# EAGLE design ConsoleSchematicFirst (EAGLE 7.1.0)
Schematic for ATTiny85 Console
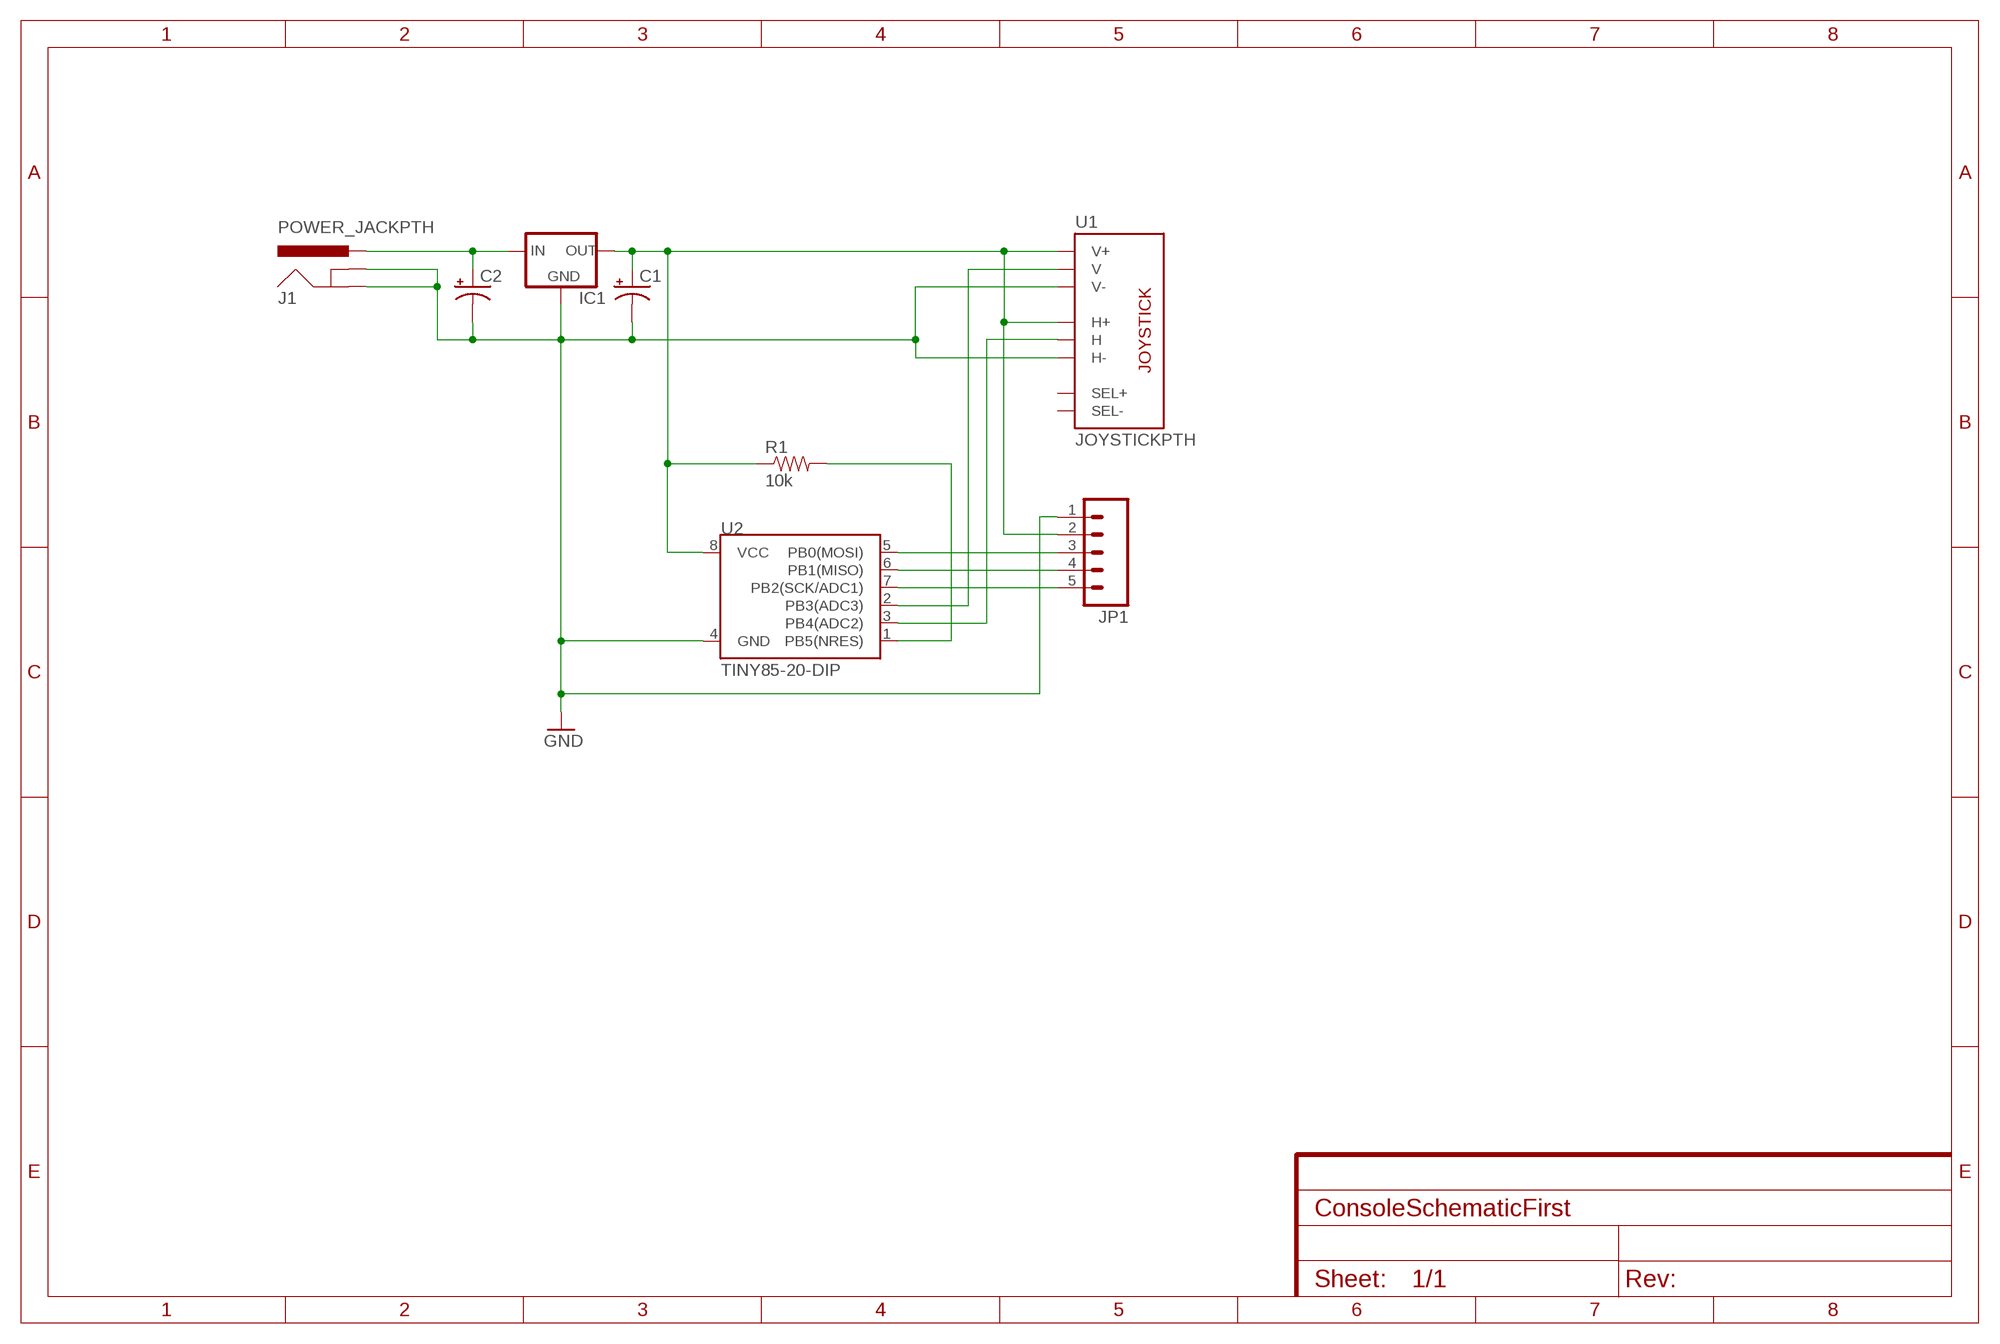
[diagram p0: schematic, sheet 1]

## Parts
C1  10UF-25V-20%(PTH)KIT  [CPOL-RADIAL-10UF-25V-KIT]
C2  10UF-25V-20%(PTH)KIT  [CPOL-RADIAL-10UF-25V-KIT]
IC1  V_REG_78XXSIDE  [78XXL]
J1  POWER_JACKPTH  [POWER_JACK_PTH]
JP1  M05LOCK  [1X05_LOCK]
R1  10k  10KOHM-1/4W-1%(PTH)HORIZ  [AXIAL-0.3]
U1  JOYSTICKPTH  [JOYSTICK]
U2  TINY85-20-DIP  ATTINY45TINY85-20-DIP  [DIP08]

## Nets
GND: C1.2(-) C2.2(-) IC1.GND J1.GND J1.GNDBREAK JP1.1 U1.H3(H-) U1.V3(V-) U2.4(GND)
N$1: C1.1(+) IC1.OUT JP1.2 R1.P$1 U1.H1(H+) U1.V1(V+) U2.8(VCC)
N$2: R1.P$2 U2.1(PB5(NRES))
N$3: U1.V2(V) U2.2(PB3(ADC3))
N$4: U1.H2(H) U2.3(PB4(ADC2))
N$5: JP1.5 U2.7(PB2(SCK/ADC1))
N$6: JP1.4 U2.6(PB1(MISO))
N$7: JP1.3 U2.5(PB0(MOSI))
N$10: C2.1(+) IC1.IN J1.PWR
Unconnected: U1.B1A(SEL+) U1.B2A(SEL-)

## Library data of the parts
C1 C2 = SparkFun-Capacitors:10UF-25V-20%(PTH): CAP-08440; PROD_ID: CAP-08440
IC1 = SparkFun-PowerIC:V_REG_78XX: Voltage Regulator Standard 7805 5V regulator. IGO (Input Ground Output). Spark Fun Electronics SKU : COM-00107
J1 = SparkFun-Connectors:POWER_JACK: Power Jack This is the standard 5.5mm barrel jack for power. The PTH is the most common, proven, reliable, footprint. The Slot footprint only works if the mill layer is transmitted to the PCB fab house so be warned. Mating wall wart : TOL-00298 (and others); PROD_ID: CONN-08197
JP1 = SparkFun-Connectors:M05: Header 5 Standard 5-pin 0.1" header. Use with straight break away headers (SKU : PRT-00116), right angle break away headers (PRT-00553), swiss pins (PRT-00743), machine pins (PRT-00117), and female headers (PRT-00115). Molex polarized connector foot print use with SKU : PRT-08230 with associated crimp pins and housings.
R1 = SparkFun-Resistors:10KOHM-1/4W-1%(PTH): RES-12183; PROD_ID: RES-12183
U1 = SparkFun-Electromechanical:JOYSTICK: Thumb Joystick Joystick commonly found in PS2 controllers. Two pots and a select switch. Footprint proven. Spark Fun Electronics SKU : COM-09032
U2 = SparkFun-DigitalIC:ATTINY45: Atmel 8-pin 2/4/8kB flash uC; PROD_ID: IC-09445

## Board
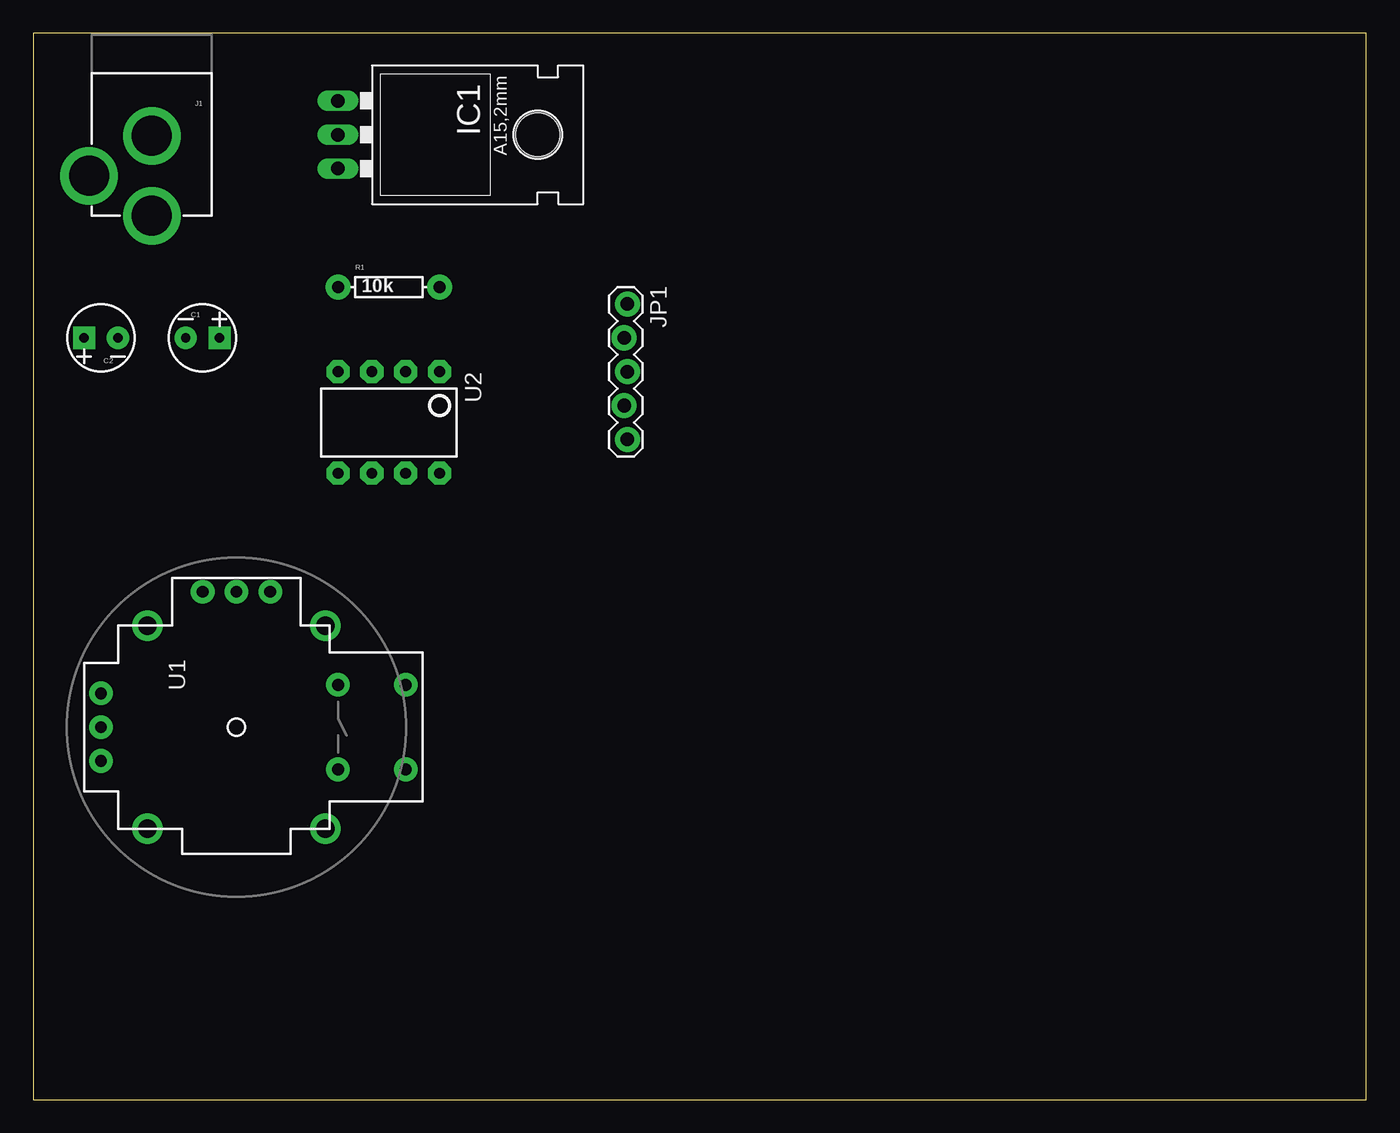
[diagram p1: board, top side]
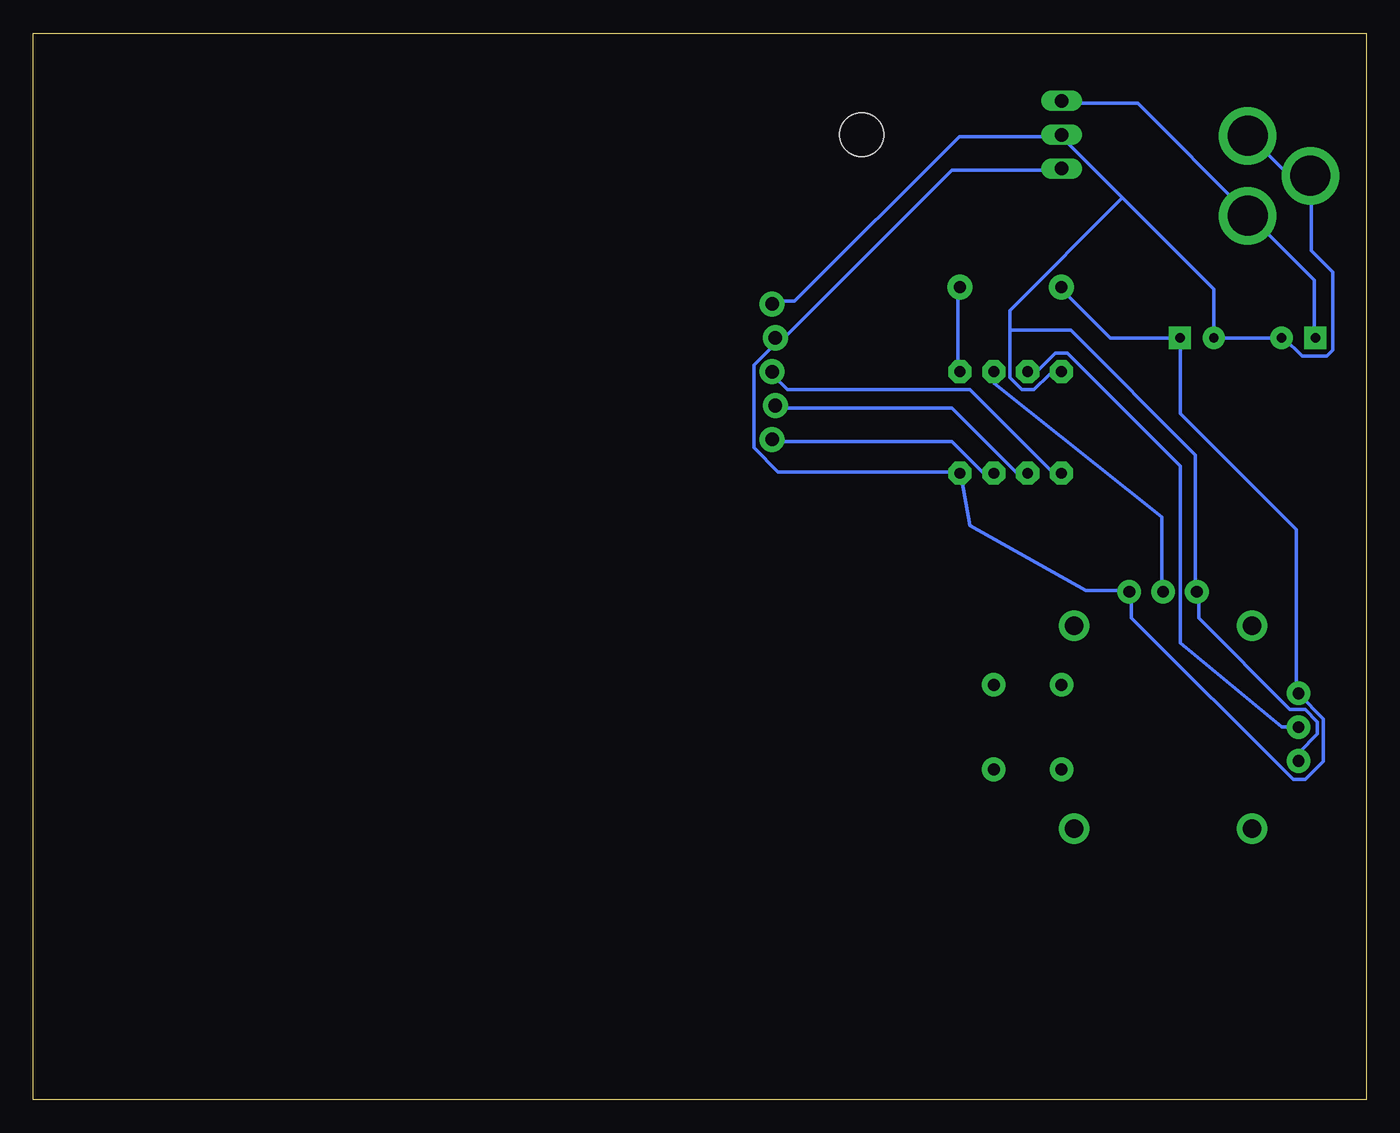
[diagram p2: board, bottom side, seen from below]

Size 100 x 80 mm. Coordinates in mm from the lower left corner, seen from the top.
Outline: 0,0 100,0 100,80 0,80 0,0
Copper layers (1*16): Top 0.035mm / dielectric 1.5mm / Bottom 0.035mm
Design rules "default": minimum track width 10mil, minimum drill 24mil, track to track 8mil, track to pad 8mil, pad to pad 8mil, via to via 8mil, smd to smd 8mil, copper to edge 40mil, drill to drill 8mil, minimum pad ring 10mil, minimum via ring 8mil, stop-mask expansion 4mil, vias tented up to drill 0mil, thermal gap 10mil

### Footprints (pad centres in the part's own frame; a part is rotated, then mirrored left to right if it is on the bottom)
CPOL-RADIAL-10UF-25V-KIT = drill 0.7 pad 1.651 square: 1 1.27,0 | drill 0.7 pad 1.651: 2 -1.27,0
78XXL = drill 1.016 long: GND 0,-3.81; IN -2.54,-3.81; OUT 2.54,-3.81 | hole 3.302: 0,11.176
POWER_JACK_PTH = drill 2.997 pad 4.318: GND 0,7.7; GNDBREAK 4.7,10.7; PWR 0,13.7
1X05_LOCK = drill 1.016 pad 1.88: 1 0,0.127; 2 2.54,-0.127; 3 5.08,0.127; 4 7.62,-0.127; 5 10.16,0.127
AXIAL-0.3 = drill 0.9 pad 1.88: P$1 -3.81,0; P$2 3.81,0
JOYSTICK = drill 0.9 pad 1.778: B1A -3.175,12.7; B1B 3.175,12.7; B2A -3.175,7.62; B2B 3.175,7.62 | drill 0.889 pad 1.778: H1 -2.54,-10.16; H2 0,-10.16; H3 2.54,-10.16; V1 -10.16,2.54; V2 -10.16,0; V3 -10.16,-2.54 | drill 1.397 pad 2.286: MOUNT1 -7.62,6.668; MOUNT2 -7.62,-6.668; MOUNT3 7.62,-6.668; MOUNT4 7.62,6.668
DIP08 = drill 0.813 pad 1.727 octagon: 1 -3.81,-3.81; 2 -1.27,-3.81; 3 1.27,-3.81; 4 3.81,-3.81; 5 3.81,3.81; 6 1.27,3.81; 7 -1.27,3.81; 8 -3.81,3.81

### Placement (x,y rotation side)
C1  12.7,57.15 0 top
C2  5.08,57.15 180 top
IC1  26.67,72.39 270 top
J1  8.89,80.01 180 top
JP1  44.45,59.69 270 top
R1  26.67,60.96 0 top
U1  15.24,27.94 270 top
U2  26.67,50.8 180 top

### Tracks (layer width: path | path; a pad name or v marks a point on that pad's centre or on a via)
GND
  Bottom 0.254: J1.GND 8.69,72.24 5.94,69.49 4.34,69.49 J1.GNDBREAK 4.12,69.27 4.12,63.68 2.52,62.08 2.52,56.24 2.97,55.78 4.8,55.78 6.17,57.15 C2.2 C1.2 11.43,60.81 18.29,67.67 | U1.H3 5.03,25.6 5.03,26.06 3.66,27.43 3.66,28.35 4.57,29.26 5.71,29.26 12.57,36.12 12.57,37.95 U1.V3 12.8,38.18 12.8,48.36 22.17,57.73 26.75,57.73 | 18.29,67.67 22.86,72.24 | 26.75,57.73 26.75,59.21 18.29,67.67 | 26.75,57.73 26.75,54.18 25.83,53.26 24.92,53.26 23.77,54.41 22.86,54.41 U2.4 | 22.86,72.24 30.53,72.24 42.88,59.89 44.58,59.89 JP1.1 | 22.86,72.24 IC1.GND
N$1
  Bottom 0.254: IC1.OUT 22.86,69.72 31.09,69.72 43.66,57.15 JP1.2 44.35,57.15 44.35,56.69 45.95,55.09 45.95,48.92 44.12,47.09 30.63,47.09 U2.8 30.4,46.86 29.72,43.05 21.03,38.18 17.83,38.18 U1.V1 17.6,37.95 17.6,36.12 5.49,24 4.57,24 3.2,25.38 3.2,28.57 5.03,30.4 U1.H1 5.26,30.63 5.26,42.77 13.95,51.46 13.95,57.15 C1.1 19.2,57.15 22.86,60.81 R1.P$1
N$2
  Bottom 0.254: U2.1 30.63,54.63 30.63,60.81 R1.P$2
N$3
  Bottom 0.254: U2.2 27.89,54.41 27.89,53.72 15.32,43.69 15.32,38.18 U1.V2
N$4
  Bottom 0.254: U1.H2 6.35,27.94 13.95,34.27 13.95,47.55 22.4,56.01 23.32,56.01 24.69,54.63 25.38,54.63 U2.3
N$5
  Bottom 0.254: U2.7 28.12,47.09 28.8,47.09 31.09,49.38 44.58,49.38 JP1.5
N$6
  Bottom 0.254: U2.6 25.6,47.09 26.29,47.09 31.09,51.89 44.12,51.89 JP1.4
N$7
  Bottom 0.254: U2.5 22.86,47.09 23.55,47.09 29.72,53.26 43.43,53.26 44.58,54.41 JP1.3
N$10
  Bottom 0.254: IC1.IN 22.86,74.75 17.14,74.75 8.91,66.52 J1.PWR 8.69,66.29 3.89,61.49 3.89,57.15 C2.1